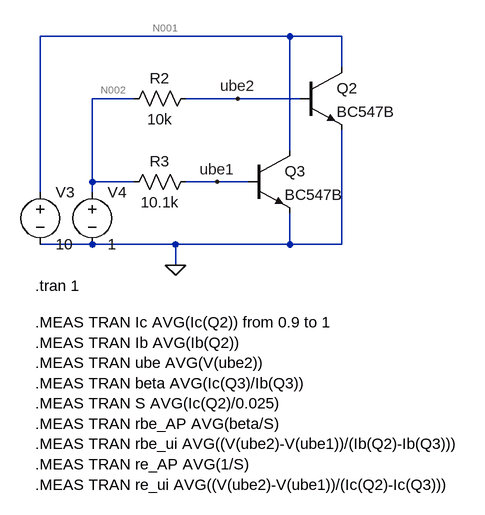
[diagram p0: schematic Tr_S_rbe_rb.asc]
Tr_S_rbe_rb.asc, the LTspice schematic file:
Version 4
SHEET 1 880 680
WIRE -3808 -1472 -4192 -1472
WIRE -3728 -1472 -3808 -1472
WIRE -3728 -1424 -3728 -1472
WIRE -4048 -1376 -4112 -1376
WIRE -3888 -1376 -3968 -1376
WIRE -3792 -1376 -3888 -1376
WIRE -3808 -1296 -3808 -1472
WIRE -4112 -1248 -4112 -1376
WIRE -4048 -1248 -4112 -1248
WIRE -3920 -1248 -3968 -1248
WIRE -3872 -1248 -3920 -1248
WIRE -4192 -1232 -4192 -1472
WIRE -4112 -1232 -4112 -1248
WIRE -4112 -1152 -4192 -1152
WIRE -3984 -1152 -4112 -1152
WIRE -3808 -1152 -3808 -1200
WIRE -3808 -1152 -3984 -1152
WIRE -3728 -1152 -3728 -1328
WIRE -3728 -1152 -3808 -1152
WIRE -3984 -1120 -3984 -1152
FLAG -3984 -1120 0
FLAG -3920 -1248 ube1
FLAG -3888 -1376 ube2
SYMBOL voltage -4192 -1248 R0
WINDOW 123 0 0 Left 2
WINDOW 39 0 0 Left 2
SYMATTR InstName V3
SYMATTR Value 10
SYMBOL npn -3792 -1424 R0
SYMATTR InstName Q2
SYMATTR Value BC547B
SYMBOL res -3952 -1392 R90
WINDOW 0 0 56 VBottom 2
WINDOW 3 32 56 VTop 2
SYMATTR InstName R2
SYMATTR Value 10k
SYMBOL voltage -4112 -1248 R0
WINDOW 123 0 0 Left 2
WINDOW 39 0 0 Left 2
SYMATTR InstName V4
SYMATTR Value 1
SYMBOL npn -3872 -1296 R0
SYMATTR InstName Q3
SYMATTR Value BC547B
SYMBOL res -3952 -1264 R90
WINDOW 0 0 56 VBottom 2
WINDOW 3 32 56 VTop 2
SYMATTR InstName R3
SYMATTR Value 10.1k
TEXT -4200 -1032 Left 2 !.MEAS TRAN Ic AVG(Ic(Q2)) from 0.9 to 1\n.MEAS TRAN Ib AVG(Ib(Q2))\n.MEAS TRAN ube AVG(V(ube2))\n.MEAS TRAN beta AVG(Ic(Q3)/Ib(Q3))\n.MEAS TRAN S AVG(Ic(Q2)/0.025)\n.MEAS TRAN rbe_AP AVG(beta/S)\n.MEAS TRAN rbe_ui AVG((V(ube2)-V(ube1))/(Ib(Q2)-Ib(Q3)))\n.MEAS TRAN re_AP AVG(1/S)\n.MEAS TRAN re_ui AVG((V(ube2)-V(ube1))/(Ic(Q2)-Ic(Q3)))
TEXT -4200 -1088 Left 2 !.tran 1

The netlist it stands for:
* Tr_S_rbe_rb.asc
V3 N001 0 10
Q2 N001 ube2 0 0 BC547B
R2 ube2 N002 10k
V4 N002 0 1
Q3 N001 ube1 0 0 BC547B
R3 ube1 N002 10.1k
.model NPN NPN
.model PNP PNP
.lib standard.bjt
.MEAS TRAN Ic AVG(Ic(Q2)) from 0.9 to 1
.MEAS TRAN Ib AVG(Ib(Q2))
.MEAS TRAN ube AVG(V(ube2))
.MEAS TRAN beta AVG(Ic(Q3)/Ib(Q3))
.MEAS TRAN S AVG(Ic(Q2)/0.025)
.MEAS TRAN rbe_AP AVG(beta/S)
.MEAS TRAN rbe_ui AVG((V(ube2)-V(ube1))/(Ib(Q2)-Ib(Q3)))
.MEAS TRAN re_AP AVG(1/S)
.MEAS TRAN re_ui AVG((V(ube2)-V(ube1))/(Ic(Q2)-Ic(Q3)))
.tran 1
.backanno
.end

* Results of the author's LTspice run, read from the files saved beside the schematic
* Operating Point, zero values left out:
*   V(n001) = 10 V
*   V(ube2) = 698.8 mV
*   V(n002) = 1 V
*   V(ube1) = 698.6 mV
*   Ic(Q3) = 9.236 mA
*   Ib(Q3) = 29.85 µA
*   Ie(Q3) = -9.266 mA
*   Ic(Q2) = 9.315 mA
*   Ib(Q2) = 30.12 µA
*   Ie(Q2) = -9.346 mA
*   I(R3) = -29.85 µA
*   I(R2) = -30.12 µA
*   I(V4) = -59.96 µA
*   I(V3) = -18.55 mA
* From the log:
*   ic: AVG(ic(q2))=0.0093154 FROM 0.9 TO 1
*   ib: AVG(ib(q2))=3.01176e-005 FROM 0 TO 1
*   ube: AVG(v(ube2))=0.698824 FROM 0 TO 1
*   beta: AVG(ic(q3)/ib(q3))=309.454 FROM 0 TO 1
*   s: AVG(ic(q2)/0.025)=0.372616 FROM 0 TO 1
*   rbe_ap: AVG(beta/s)=830.489 FROM 0 TO 1
*   rbe_ui: AVG((v(ube2)-v(ube1))/(ib(q2)-ib(q3)))=1009.35 FROM 0 TO 1
*   re_ap: AVG(1/s)=2.68373 FROM 0 TO 1
*   re_ui: AVG((v(ube2)-v(ube1))/(ic(q2)-ic(q3)))=3.4502 FROM 0 TO 1